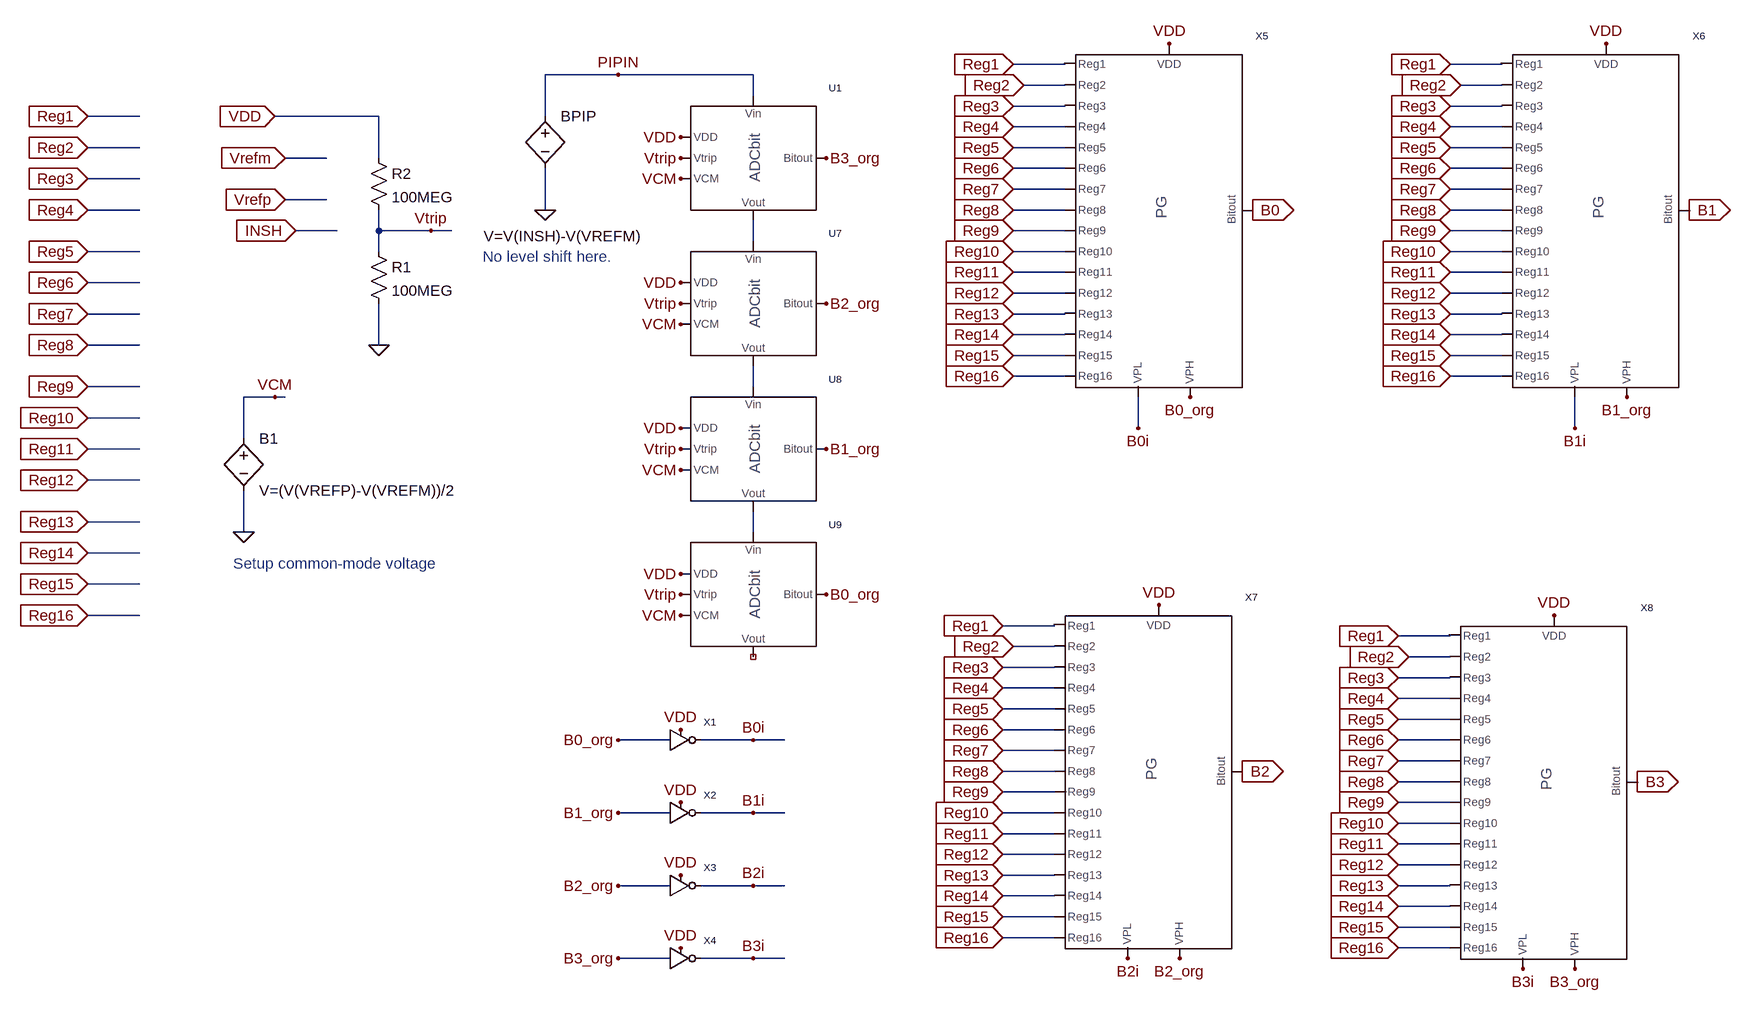
[diagram p0: schematic 4_bit_fine_ADC_LSB.asc]
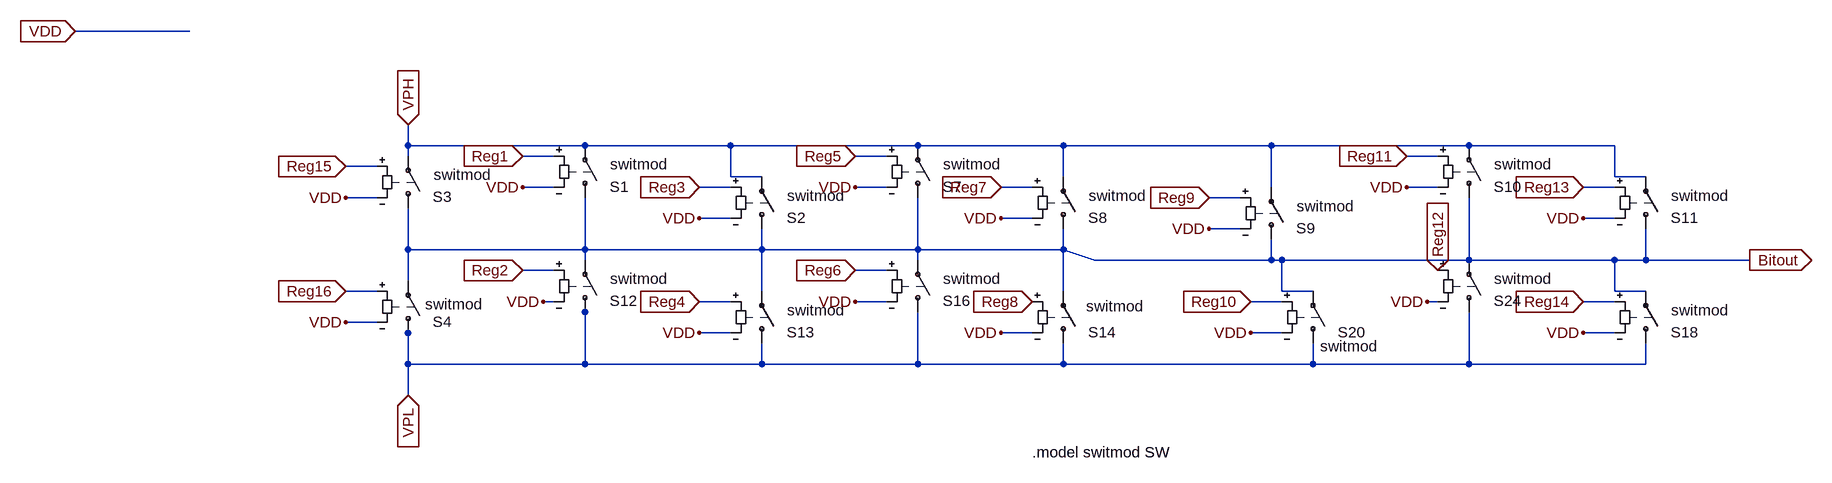
[diagram p1: sub-circuit pg.asc]
4_bit_fine_ADC_LSB.asc, the LTspice schematic file:
Version 4
SHEET 1 4400 868
WIRE 1488 -1136 1408 -1136
WIRE 2160 -1136 2080 -1136
WIRE 800 -1120 688 -1120
WIRE 1008 -1120 800 -1120
WIRE 1488 -1104 1424 -1104
WIRE 2160 -1104 2096 -1104
WIRE 1008 -1088 1008 -1120
WIRE 1488 -1072 1408 -1072
WIRE 2160 -1072 2080 -1072
WIRE 64 -1056 -16 -1056
WIRE 432 -1056 272 -1056
WIRE 688 -1056 688 -1120
WIRE 1488 -1040 1408 -1040
WIRE 2160 -1040 2080 -1040
WIRE 64 -1008 -16 -1008
WIRE 1488 -1008 1408 -1008
WIRE 2160 -1008 2080 -1008
WIRE 352 -992 288 -992
WIRE 432 -992 432 -1056
WIRE 1488 -976 1408 -976
WIRE 2160 -976 2080 -976
WIRE 64 -960 -16 -960
WIRE 1488 -944 1408 -944
WIRE 2160 -944 2080 -944
WIRE 352 -928 288 -928
WIRE 64 -912 -16 -912
WIRE 688 -912 688 -976
WIRE 1488 -912 1408 -912
WIRE 2160 -912 2080 -912
WIRE 368 -880 304 -880
WIRE 432 -880 432 -912
WIRE 512 -880 432 -880
WIRE 544 -880 512 -880
WIRE 1488 -880 1408 -880
WIRE 2160 -880 2080 -880
WIRE 1008 -864 1008 -896
WIRE 64 -848 -16 -848
WIRE 432 -848 432 -880
WIRE 1488 -848 1408 -848
WIRE 2160 -848 2080 -848
WIRE 1488 -816 1408 -816
WIRE 2160 -816 2080 -816
WIRE 64 -800 -16 -800
WIRE 1488 -784 1408 -784
WIRE 2160 -784 2080 -784
WIRE 64 -752 -16 -752
WIRE 1488 -752 1408 -752
WIRE 2160 -752 2080 -752
WIRE 1488 -720 1408 -720
WIRE 2160 -720 2080 -720
WIRE 64 -704 -16 -704
WIRE 432 -704 432 -768
WIRE 1488 -688 1408 -688
WIRE 2160 -688 2080 -688
WIRE 1488 -656 1408 -656
WIRE 2160 -656 2080 -656
WIRE 64 -640 -16 -640
WIRE 1008 -640 1008 -672
WIRE 272 -624 224 -624
WIRE 288 -624 272 -624
WIRE 64 -592 -16 -592
WIRE 1600 -576 1600 -624
WIRE 2272 -576 2272 -624
WIRE 224 -560 224 -624
WIRE 64 -544 -16 -544
WIRE 64 -496 -16 -496
WIRE 64 -432 -16 -432
WIRE 224 -416 224 -480
WIRE 1008 -416 1008 -448
WIRE 64 -384 -16 -384
WIRE 64 -336 -16 -336
WIRE 64 -288 -16 -288
WIRE 1472 -272 1392 -272
WIRE 2080 -256 2000 -256
WIRE 1472 -240 1408 -240
WIRE 2080 -224 2016 -224
WIRE 1472 -208 1392 -208
WIRE 2080 -192 2000 -192
WIRE 1472 -176 1392 -176
WIRE 2080 -160 2000 -160
WIRE 1472 -144 1392 -144
WIRE 2080 -128 2000 -128
WIRE 1472 -112 1392 -112
WIRE 880 -96 800 -96
WIRE 1008 -96 928 -96
WIRE 1056 -96 1008 -96
WIRE 2080 -96 2000 -96
WIRE 1472 -80 1392 -80
WIRE 2080 -64 2000 -64
WIRE 1472 -48 1392 -48
WIRE 2080 -32 2000 -32
WIRE 1472 -16 1392 -16
WIRE 2080 0 2000 0
WIRE 880 16 800 16
WIRE 1008 16 928 16
WIRE 1056 16 1008 16
WIRE 1472 16 1392 16
WIRE 2080 32 2000 32
WIRE 1472 48 1392 48
WIRE 2080 64 2000 64
WIRE 1472 80 1392 80
WIRE 2080 96 2000 96
WIRE 1472 112 1392 112
WIRE 880 128 800 128
WIRE 1008 128 928 128
WIRE 1056 128 1008 128
WIRE 2080 128 2000 128
WIRE 1472 144 1392 144
WIRE 2080 160 2000 160
WIRE 1472 176 1392 176
WIRE 2080 192 2000 192
WIRE 1472 208 1392 208
WIRE 2080 224 2000 224
WIRE 880 240 800 240
WIRE 1008 240 928 240
WIRE 1056 240 1008 240
FLAG 512 -880 Vtrip
FLAG 432 -704 0
FLAG 272 -1056 VDD
IOPIN 272 -1056 In
FLAG 224 -416 0
FLAG 272 -624 VCM
FLAG 688 -912 0
FLAG 896 -992 Vtrip
FLAG 896 -1024 VDD
FLAG 896 -960 VCM
FLAG 896 -768 Vtrip
FLAG 896 -800 VDD
FLAG 896 -736 VCM
FLAG 1120 -768 B2_org
FLAG 896 -544 Vtrip
FLAG 896 -576 VDD
FLAG 896 -512 VCM
FLAG 1120 -544 B1_org
FLAG 896 -320 Vtrip
FLAG 896 -352 VDD
FLAG 896 -288 VCM
FLAG 1120 -320 B0_org
FLAG 800 -1120 PIPIN
FLAG 288 -992 Vrefm
IOPIN 288 -992 In
FLAG 288 -928 Vrefp
IOPIN 288 -928 In
FLAG 1120 -992 B3_org
FLAG 304 -880 INSH
IOPIN 304 -880 In
FLAG -16 -1056 Reg1
IOPIN -16 -1056 In
FLAG -16 -1008 Reg2
IOPIN -16 -1008 In
FLAG -16 -960 Reg3
IOPIN -16 -960 In
FLAG -16 -912 Reg4
IOPIN -16 -912 In
FLAG -16 -848 Reg5
IOPIN -16 -848 In
FLAG -16 -800 Reg6
IOPIN -16 -800 In
FLAG -16 -752 Reg7
IOPIN -16 -752 In
FLAG -16 -704 Reg8
IOPIN -16 -704 In
FLAG -16 -640 Reg9
IOPIN -16 -640 In
FLAG -16 -592 Reg10
IOPIN -16 -592 In
FLAG -16 -544 Reg11
IOPIN -16 -544 In
FLAG -16 -496 Reg12
IOPIN -16 -496 In
FLAG -16 -432 Reg13
IOPIN -16 -432 In
FLAG -16 -384 Reg14
IOPIN -16 -384 In
FLAG -16 -336 Reg15
IOPIN -16 -336 In
FLAG -16 -288 Reg16
IOPIN -16 -288 In
FLAG 800 -96 B0_org
FLAG 896 -112 VDD
FLAG 1008 -96 B0i
FLAG 800 16 B1_org
FLAG 896 0 VDD
FLAG 1008 16 B1i
FLAG 800 128 B2_org
FLAG 896 112 VDD
FLAG 1008 128 B2i
FLAG 800 240 B3_org
FLAG 896 224 VDD
FLAG 1008 240 B3i
FLAG 1408 -1136 Reg1
IOPIN 1408 -1136 In
FLAG 1424 -1104 Reg2
IOPIN 1424 -1104 In
FLAG 1408 -1072 Reg3
IOPIN 1408 -1072 In
FLAG 1408 -1040 Reg4
IOPIN 1408 -1040 In
FLAG 1408 -1008 Reg5
IOPIN 1408 -1008 In
FLAG 1408 -976 Reg6
IOPIN 1408 -976 In
FLAG 1408 -944 Reg7
IOPIN 1408 -944 In
FLAG 1408 -912 Reg8
IOPIN 1408 -912 In
FLAG 1408 -880 Reg9
IOPIN 1408 -880 In
FLAG 1408 -848 Reg10
IOPIN 1408 -848 In
FLAG 1408 -816 Reg11
IOPIN 1408 -816 In
FLAG 1408 -784 Reg12
IOPIN 1408 -784 In
FLAG 1408 -752 Reg13
IOPIN 1408 -752 In
FLAG 1408 -720 Reg14
IOPIN 1408 -720 In
FLAG 1408 -688 Reg15
IOPIN 1408 -688 In
FLAG 1408 -656 Reg16
IOPIN 1408 -656 In
FLAG 1648 -1168 VDD
FLAG 2080 -1136 Reg1
IOPIN 2080 -1136 In
FLAG 2096 -1104 Reg2
IOPIN 2096 -1104 In
FLAG 2080 -1072 Reg3
IOPIN 2080 -1072 In
FLAG 2080 -1040 Reg4
IOPIN 2080 -1040 In
FLAG 2080 -1008 Reg5
IOPIN 2080 -1008 In
FLAG 2080 -976 Reg6
IOPIN 2080 -976 In
FLAG 2080 -944 Reg7
IOPIN 2080 -944 In
FLAG 2080 -912 Reg8
IOPIN 2080 -912 In
FLAG 2080 -880 Reg9
IOPIN 2080 -880 In
FLAG 2080 -848 Reg10
IOPIN 2080 -848 In
FLAG 2080 -816 Reg11
IOPIN 2080 -816 In
FLAG 2080 -784 Reg12
IOPIN 2080 -784 In
FLAG 2080 -752 Reg13
IOPIN 2080 -752 In
FLAG 2080 -720 Reg14
IOPIN 2080 -720 In
FLAG 2080 -688 Reg15
IOPIN 2080 -688 In
FLAG 2080 -656 Reg16
IOPIN 2080 -656 In
FLAG 2320 -1168 VDD
FLAG 1392 -272 Reg1
IOPIN 1392 -272 In
FLAG 1408 -240 Reg2
IOPIN 1408 -240 In
FLAG 1392 -208 Reg3
IOPIN 1392 -208 In
FLAG 1392 -176 Reg4
IOPIN 1392 -176 In
FLAG 1392 -144 Reg5
IOPIN 1392 -144 In
FLAG 1392 -112 Reg6
IOPIN 1392 -112 In
FLAG 1392 -80 Reg7
IOPIN 1392 -80 In
FLAG 1392 -48 Reg8
IOPIN 1392 -48 In
FLAG 1392 -16 Reg9
IOPIN 1392 -16 In
FLAG 1392 16 Reg10
IOPIN 1392 16 In
FLAG 1392 48 Reg11
IOPIN 1392 48 In
FLAG 1392 80 Reg12
IOPIN 1392 80 In
FLAG 1392 112 Reg13
IOPIN 1392 112 In
FLAG 1392 144 Reg14
IOPIN 1392 144 In
FLAG 1392 176 Reg15
IOPIN 1392 176 In
FLAG 1392 208 Reg16
IOPIN 1392 208 In
FLAG 1632 -304 VDD
FLAG 2000 -256 Reg1
IOPIN 2000 -256 In
FLAG 2016 -224 Reg2
IOPIN 2016 -224 In
FLAG 2000 -192 Reg3
IOPIN 2000 -192 In
FLAG 2000 -160 Reg4
IOPIN 2000 -160 In
FLAG 2000 -128 Reg5
IOPIN 2000 -128 In
FLAG 2000 -96 Reg6
IOPIN 2000 -96 In
FLAG 2000 -64 Reg7
IOPIN 2000 -64 In
FLAG 2000 -32 Reg8
IOPIN 2000 -32 In
FLAG 2000 0 Reg9
IOPIN 2000 0 In
FLAG 2000 32 Reg10
IOPIN 2000 32 In
FLAG 2000 64 Reg11
IOPIN 2000 64 In
FLAG 2000 96 Reg12
IOPIN 2000 96 In
FLAG 2000 128 Reg13
IOPIN 2000 128 In
FLAG 2000 160 Reg14
IOPIN 2000 160 In
FLAG 2000 192 Reg15
IOPIN 2000 192 In
FLAG 2000 224 Reg16
IOPIN 2000 224 In
FLAG 2240 -288 VDD
FLAG 1680 -624 B0_org
FLAG 1600 -576 B0i
FLAG 2272 -576 B1i
FLAG 2352 -624 B1_org
FLAG 1664 240 B2_org
FLAG 2272 256 B3_org
FLAG 2192 256 B3i
FLAG 1584 240 B2i
FLAG 1760 -48 B2
IOPIN 1760 -48 Out
FLAG 2448 -912 B1
IOPIN 2448 -912 Out
FLAG 2368 -32 B3
IOPIN 2368 -32 Out
FLAG 1776 -912 B0
IOPIN 1776 -912 Out
SYMBOL res 416 -864 R0
SYMATTR InstName R1
SYMATTR Value 100MEG
SYMBOL res 416 -1008 R0
SYMATTR InstName R2
SYMATTR Value 100MEG
SYMBOL bv 224 -576 R0
SYMATTR InstName B1
SYMATTR Value V=(V(VREFP)-V(VREFM))/2
SYMBOL bv 688 -1072 R0
WINDOW 3 -95 200 Left 0
SYMATTR Value V=V(INSH)-V(VREFM)
SYMATTR InstName BPIP
SYMBOL ADCbit 864 -976 R0
SYMATTR InstName U1
SYMBOL ADCbit 864 -752 R0
SYMATTR InstName U7
SYMBOL ADCbit 864 -528 R0
SYMATTR InstName U8
SYMBOL ADCbit 864 -304 R0
SYMATTR InstName U9
SYMBOL inverter 880 -96 R0
SYMATTR InstName X1
SYMBOL inverter 880 16 R0
SYMATTR InstName X2
SYMBOL inverter 880 128 R0
SYMATTR InstName X3
SYMBOL inverter 880 240 R0
SYMATTR InstName X4
SYMBOL PG 1648 -848 R0
SYMATTR InstName X5
SYMBOL PG 2320 -848 R0
SYMATTR InstName X6
SYMBOL PG 1632 16 R0
SYMATTR InstName X7
SYMBOL PG 2240 32 R0
SYMATTR InstName X8
TEXT 592 -840 Left 0 ;No level shift here.
TEXT 208 -368 Left 0 ;Setup common-mode voltage

pg.asc, the sub-circuit schematic file:
Version 4
SHEET 1 3216 696
WIRE 256 -1472 80 -1472
WIRE 592 -1296 592 -1328
WIRE 864 -1296 592 -1296
WIRE 1088 -1296 864 -1296
WIRE 1376 -1296 1088 -1296
WIRE 1600 -1296 1376 -1296
WIRE 1920 -1296 1600 -1296
WIRE 2224 -1296 1920 -1296
WIRE 2448 -1296 2224 -1296
WIRE 592 -1280 592 -1296
WIRE 816 -1280 768 -1280
WIRE 1328 -1280 1280 -1280
WIRE 2176 -1280 2128 -1280
WIRE 544 -1264 496 -1264
WIRE 1088 -1248 1088 -1296
WIRE 1136 -1248 1088 -1248
WIRE 1600 -1248 1600 -1296
WIRE 2448 -1248 2448 -1296
WIRE 2496 -1248 2448 -1248
WIRE 816 -1232 768 -1232
WIRE 1088 -1232 1040 -1232
WIRE 1328 -1232 1280 -1232
WIRE 1552 -1232 1504 -1232
WIRE 1920 -1232 1920 -1296
WIRE 2176 -1232 2128 -1232
WIRE 2448 -1232 2400 -1232
WIRE 544 -1216 496 -1216
WIRE 1872 -1216 1824 -1216
WIRE 1088 -1184 1040 -1184
WIRE 1552 -1184 1504 -1184
WIRE 2448 -1184 2400 -1184
WIRE 1872 -1168 1824 -1168
WIRE 592 -1136 592 -1200
WIRE 864 -1136 864 -1216
WIRE 864 -1136 592 -1136
WIRE 1136 -1136 1136 -1168
WIRE 1136 -1136 864 -1136
WIRE 1376 -1136 1376 -1216
WIRE 1376 -1136 1136 -1136
WIRE 1600 -1136 1600 -1168
WIRE 1600 -1136 1376 -1136
WIRE 864 -1120 864 -1136
WIRE 1376 -1120 1376 -1136
WIRE 1648 -1120 1600 -1136
WIRE 1920 -1120 1920 -1152
WIRE 1920 -1120 1648 -1120
WIRE 1936 -1120 1920 -1120
WIRE 2224 -1120 2224 -1216
WIRE 2224 -1120 1936 -1120
WIRE 2448 -1120 2224 -1120
WIRE 2496 -1120 2496 -1168
WIRE 2496 -1120 2448 -1120
WIRE 2656 -1120 2496 -1120
WIRE 816 -1104 768 -1104
WIRE 1328 -1104 1280 -1104
WIRE 592 -1088 592 -1136
WIRE 544 -1072 496 -1072
WIRE 1136 -1072 1136 -1136
WIRE 1600 -1072 1600 -1136
WIRE 1936 -1072 1936 -1120
WIRE 1984 -1072 1936 -1072
WIRE 2448 -1072 2448 -1120
WIRE 2496 -1072 2448 -1072
WIRE 816 -1056 800 -1056
WIRE 1088 -1056 1040 -1056
WIRE 1328 -1056 1280 -1056
WIRE 1568 -1056 1552 -1056
WIRE 1936 -1056 1888 -1056
WIRE 2176 -1056 2160 -1056
WIRE 2448 -1056 2400 -1056
WIRE 864 -1040 864 -1056
WIRE 544 -1024 496 -1024
WIRE 592 -1008 592 -1024
WIRE 1088 -1008 1040 -1008
WIRE 1552 -1008 1504 -1008
WIRE 1936 -1008 1888 -1008
WIRE 2448 -1008 2400 -1008
WIRE 592 -960 592 -1008
WIRE 864 -960 864 -1040
WIRE 864 -960 592 -960
WIRE 1136 -960 1136 -992
WIRE 1136 -960 864 -960
WIRE 1376 -960 1376 -1040
WIRE 1376 -960 1136 -960
WIRE 1600 -960 1600 -992
WIRE 1600 -960 1376 -960
WIRE 1984 -960 1984 -992
WIRE 1984 -960 1600 -960
WIRE 2224 -960 2224 -1040
WIRE 2224 -960 1984 -960
WIRE 2496 -960 2496 -992
WIRE 2496 -960 2224 -960
WIRE 592 -912 592 -960
FLAG 496 -1216 VDD
FLAG 2656 -1120 Bitout
IOPIN 2656 -1120 Out
FLAG 592 -912 VPL
IOPIN 592 -912 In
FLAG 592 -1328 VPH
IOPIN 592 -1328 In
FLAG 496 -1264 Reg15
IOPIN 496 -1264 In
FLAG 768 -1232 VDD
FLAG 768 -1280 Reg1
IOPIN 768 -1280 In
FLAG 1040 -1184 VDD
FLAG 1040 -1232 Reg3
IOPIN 1040 -1232 In
FLAG 1280 -1232 VDD
FLAG 1280 -1280 Reg5
IOPIN 1280 -1280 In
FLAG 1504 -1184 VDD
FLAG 1504 -1232 Reg7
IOPIN 1504 -1232 In
FLAG 1824 -1168 VDD
FLAG 1824 -1216 Reg9
IOPIN 1824 -1216 In
FLAG 2128 -1232 VDD
FLAG 2128 -1280 Reg11
IOPIN 2128 -1280 In
FLAG 2400 -1184 VDD
FLAG 2400 -1232 Reg13
IOPIN 2400 -1232 In
FLAG 80 -1472 VDD
IOPIN 80 -1472 In
FLAG 496 -1072 Reg16
IOPIN 496 -1072 In
FLAG 768 -1104 Reg2
IOPIN 768 -1104 In
FLAG 1040 -1056 Reg4
IOPIN 1040 -1056 In
FLAG 1280 -1104 Reg6
IOPIN 1280 -1104 In
FLAG 1552 -1056 Reg8
IOPIN 1552 -1056 In
FLAG 1888 -1056 Reg10
IOPIN 1888 -1056 In
FLAG 2176 -1104 Reg12
IOPIN 2176 -1104 In
FLAG 2400 -1056 Reg14
IOPIN 2400 -1056 In
FLAG 496 -1024 VDD
FLAG 1040 -1008 VDD
FLAG 800 -1056 VDD
FLAG 1280 -1056 VDD
FLAG 1504 -1008 VDD
FLAG 1888 -1008 VDD
FLAG 2160 -1056 VDD
FLAG 2400 -1008 VDD
SYMBOL sw 592 -1184 M180
WINDOW 3 24 -12 Left 0
WINDOW 38 39 67 Left 0
WINDOW 0 38 33 Left 0
SYMATTR Value ""
SYMATTR SpiceModel switmod
SYMATTR InstName S3
SYMBOL sw 592 -992 M180
WINDOW 3 24 -12 Left 0
WINDOW 38 26 60 Left 0
WINDOW 0 38 33 Left 0
SYMATTR Value ""
SYMATTR SpiceModel switmod
SYMATTR InstName S4
SYMBOL sw 864 -1200 M180
WINDOW 3 24 -12 Left 0
WINDOW 38 39 67 Left 0
WINDOW 0 38 33 Left 0
SYMATTR Value ""
SYMATTR SpiceModel switmod
SYMATTR InstName S1
SYMBOL sw 1136 -1152 M180
WINDOW 3 24 -12 Left 0
WINDOW 38 39 67 Left 0
WINDOW 0 38 33 Left 0
SYMATTR Value ""
SYMATTR SpiceModel switmod
SYMATTR InstName S2
SYMBOL sw 1376 -1200 M180
WINDOW 3 24 -12 Left 0
WINDOW 38 39 67 Left 0
WINDOW 0 38 33 Left 0
SYMATTR Value ""
SYMATTR SpiceModel switmod
SYMATTR InstName S7
SYMBOL sw 1600 -1152 M180
WINDOW 3 24 -12 Left 0
WINDOW 38 39 67 Left 0
WINDOW 0 38 33 Left 0
SYMATTR Value ""
SYMATTR SpiceModel switmod
SYMATTR InstName S8
SYMBOL sw 1920 -1136 M180
WINDOW 3 24 -12 Left 0
WINDOW 38 39 67 Left 0
WINDOW 0 38 33 Left 0
SYMATTR Value ""
SYMATTR SpiceModel switmod
SYMATTR InstName S9
SYMBOL sw 2224 -1200 M180
WINDOW 3 24 -12 Left 0
WINDOW 38 39 67 Left 0
WINDOW 0 38 33 Left 0
SYMATTR Value ""
SYMATTR SpiceModel switmod
SYMATTR InstName S10
SYMBOL sw 2496 -1152 M180
WINDOW 3 24 -12 Left 0
WINDOW 38 39 67 Left 0
WINDOW 0 38 33 Left 0
SYMATTR Value ""
SYMATTR SpiceModel switmod
SYMATTR InstName S11
SYMBOL sw 864 -1024 M180
WINDOW 3 24 -12 Left 0
WINDOW 38 39 67 Left 0
WINDOW 0 38 33 Left 0
SYMATTR Value ""
SYMATTR SpiceModel switmod
SYMATTR InstName S12
SYMBOL sw 1136 -976 M180
WINDOW 3 24 -12 Left 0
WINDOW 38 39 67 Left 0
WINDOW 0 38 33 Left 0
SYMATTR Value ""
SYMATTR SpiceModel switmod
SYMATTR InstName S13
SYMBOL sw 1376 -1024 M180
WINDOW 3 24 -12 Left 0
WINDOW 38 39 67 Left 0
WINDOW 0 38 33 Left 0
SYMATTR Value ""
SYMATTR SpiceModel switmod
SYMATTR InstName S16
SYMBOL sw 1984 -976 M180
WINDOW 3 24 -12 Left 0
WINDOW 38 11 11 Left 0
WINDOW 0 38 33 Left 0
SYMATTR Value ""
SYMATTR SpiceModel switmod
SYMATTR InstName S20
SYMBOL sw 2224 -1024 M180
WINDOW 3 24 -12 Left 0
WINDOW 38 39 67 Left 0
WINDOW 0 38 33 Left 0
SYMATTR Value ""
SYMATTR SpiceModel switmod
SYMATTR InstName S24
SYMBOL sw 2496 -976 M180
WINDOW 3 24 -12 Left 0
WINDOW 38 39 67 Left 0
WINDOW 0 38 33 Left 0
SYMATTR Value ""
SYMATTR SpiceModel switmod
SYMATTR InstName S18
SYMBOL sw 1600 -976 M180
WINDOW 3 24 -12 Left 0
WINDOW 38 35 73 Left 0
WINDOW 0 38 33 Left 0
SYMATTR Value ""
SYMATTR SpiceModel switmod
SYMATTR InstName S14
TEXT 1552 -824 Left 0 !.model switmod SW

The netlist it stands for:
* 4_bit_fine_ADC_LSB.asc
R1 Vtrip 0 100MEG
R2 VDD Vtrip 100MEG
B1 VCM 0 V=(V(VREFP)-V(VREFM))/2
BPIP PIPIN 0 V=V(INSH)-V(VREFM)
XU1 VDD Vtrip VCM PIPIN B3_org N001 ADCbit  ; pins VDD Vtrip VCM Vin Bitout Vout
XU7 VDD Vtrip VCM N001 B2_org N002 ADCbit  ; pins VDD Vtrip VCM Vin Bitout Vout
XU8 VDD Vtrip VCM N002 B1_org N003 ADCbit  ; pins VDD Vtrip VCM Vin Bitout Vout
XU9 VDD Vtrip VCM N003 B0_org NC_01 ADCbit  ; pins VDD Vtrip VCM Vin Bitout Vout
XX1 B0_org B0i VDD inverter  ; pins In Out VDD
XX2 B1_org B1i VDD inverter  ; pins In Out VDD
XX3 B2_org B2i VDD inverter  ; pins In Out VDD
XX4 B3_org B3i VDD inverter  ; pins In Out VDD
XX5 VDD B0i B0 B0_org Reg1 Reg2 Reg3 Reg4 Reg5 Reg6 Reg7 Reg8 Reg9 Reg10 Reg11 Reg12 Reg13 Reg14 Reg15 Reg16 pg
XX6 VDD B1i B1 B1_org Reg1 Reg2 Reg3 Reg4 Reg5 Reg6 Reg7 Reg8 Reg9 Reg10 Reg11 Reg12 Reg13 Reg14 Reg15 Reg16 pg
XX7 VDD B2i B2 B2_org Reg1 Reg2 Reg3 Reg4 Reg5 Reg6 Reg7 Reg8 Reg9 Reg10 Reg11 Reg12 Reg13 Reg14 Reg15 Reg16 pg
XX8 VDD B3i B3 B3_org Reg1 Reg2 Reg3 Reg4 Reg5 Reg6 Reg7 Reg8 Reg9 Reg10 Reg11 Reg12 Reg13 Reg14 Reg15 Reg16 pg

* block symbol definitions
.subckt pg VDD VPL Bitout VPH Reg1 Reg2 Reg3 Reg4 Reg5 Reg6 Reg7 Reg8 Reg9 Reg10 Reg11 Reg12 Reg13 Reg14 Reg15 Reg16
S3 Bitout VPH Reg15 VDD switmod
S4 VPL Bitout Reg16 VDD switmod
S1 Bitout VPH Reg1 VDD switmod
S2 Bitout VPH Reg3 VDD switmod
S7 Bitout VPH Reg5 VDD switmod
S8 Bitout VPH Reg7 VDD switmod
S9 Bitout VPH Reg9 VDD switmod
S10 Bitout VPH Reg11 VDD switmod
S11 Bitout VPH Reg13 VDD switmod
S12 VPL Bitout Reg2 VDD switmod
S13 VPL Bitout Reg4 VDD switmod
S16 VPL Bitout Reg6 VDD switmod
S20 VPL Bitout Reg10 VDD switmod
S24 VPL Bitout Reg12 VDD switmod
S18 VPL Bitout Reg14 VDD switmod
S14 VPL Bitout Reg8 VDD switmod
.model switmod SW
.ends pg

* No level shift here.
* Setup common-mode voltage
.backanno
.end